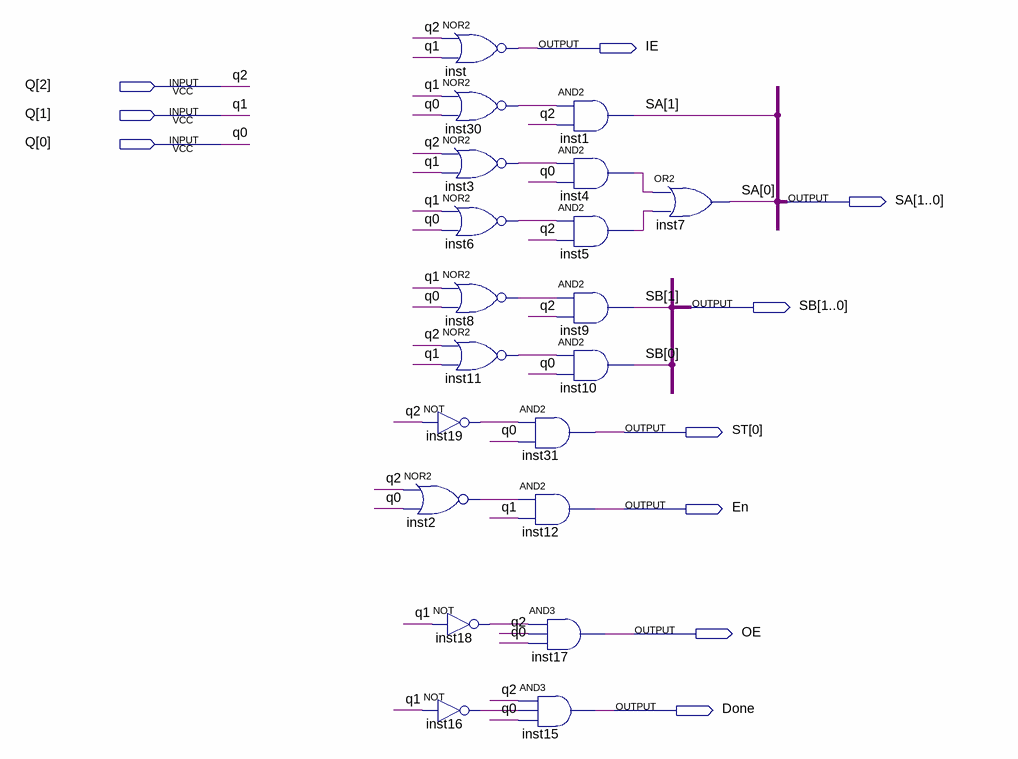
[diagram p0: schematic sheet]
// Quartus schematic NgoRa.bdf as structural Verilog: 20 symbols, 10 pins
module NgoRa (
  input  [2:0] Q,
  output IE,
  output [1:0] SA,
  output [1:0] SB,
  output [0:0] ST,
  output En,
  output OE,
  output Done
);

  wire inst2_out, inst3_out, inst4_out, inst5_out, inst6_out, inst8_out, inst11_out, inst16_out, inst18_out,
       inst19_out, inst30_out;

  nor inst2 (inst2_out, Q[2], Q[0]);
  nor inst (IE, Q[2], Q[1]);
  nor inst30 (inst30_out, Q[1], Q[0]);
  nor inst3 (inst3_out, Q[2], Q[1]);
  nor inst6 (inst6_out, Q[1], Q[0]);
  nor inst8 (inst8_out, Q[1], Q[0]);
  nor inst11 (inst11_out, Q[2], Q[1]);
  not inst19 (inst19_out, Q[2]);
  not inst18 (inst18_out, Q[1]);
  not inst16 (inst16_out, Q[1]);
  and inst1 (SA[1], inst30_out, Q[2]);
  and inst4 (inst4_out, inst3_out, Q[0]);
  and inst5 (inst5_out, inst6_out, Q[2]);
  and inst9 (SB[1], inst8_out, Q[2]);
  and inst10 (SB[0], inst11_out, Q[0]);
  and inst31 (ST[0], inst19_out, Q[0]);
  and inst12 (En, inst2_out, Q[1]);
  and inst17 (OE, inst18_out, Q[2], Q[0]);
  and inst15 (Done, Q[2], inst16_out, Q[0]);
  or inst7 (SA[0], inst4_out, inst5_out);
endmodule
